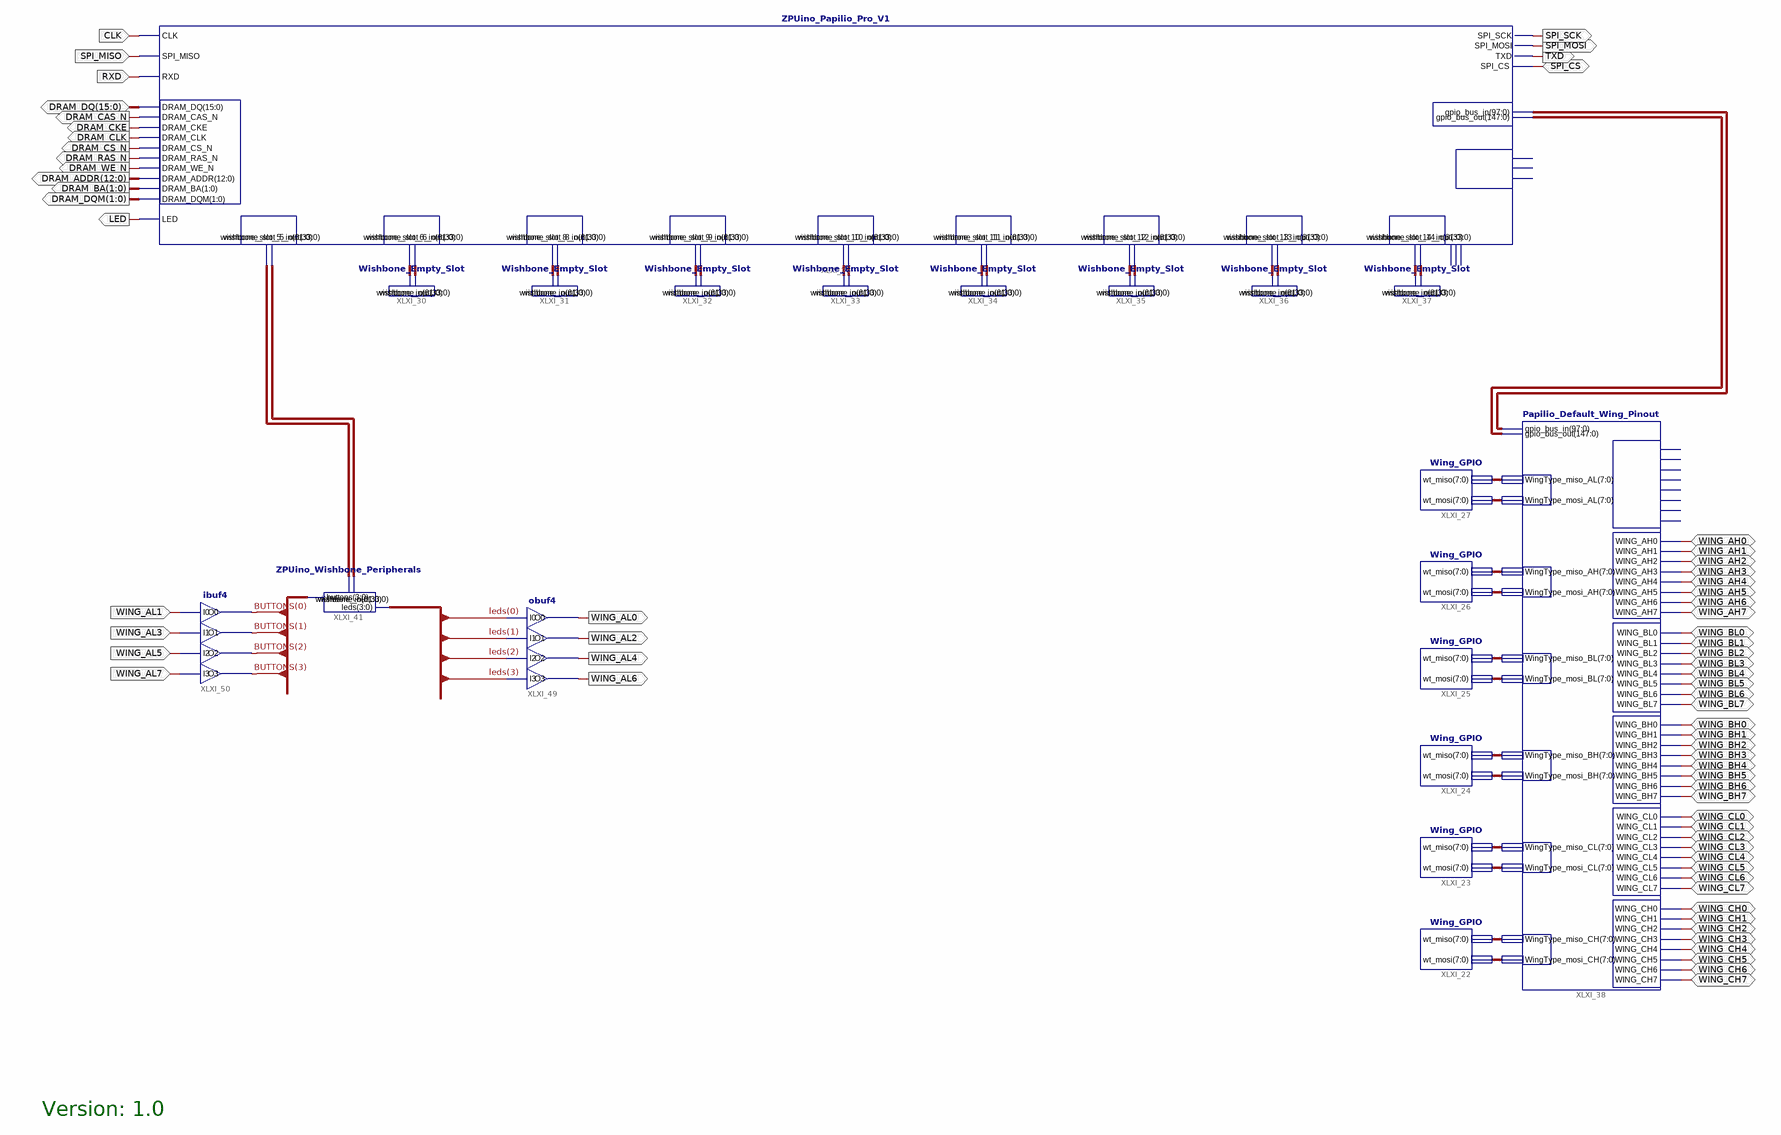
[diagram p0: schematic sheet 1]
// Xilinx ISE schematic Papilio_Pro.sch (spartan6) as structural Verilog: 19 symbols, 66 ports
module Papilio_Pro (
  input  RXD,
  input  SPI_MISO,
  input  CLK,
  input  WING_AL1,
  input  WING_AL3,
  input  WING_AL5,
  input  WING_AL7,
  inout  WING_AH0,
  inout  WING_AH1,
  inout  WING_AH2,
  inout  WING_AH3,
  inout  WING_AH4,
  inout  WING_AH5,
  inout  WING_AH6,
  inout  WING_AH7,
  inout  WING_BL0,
  inout  WING_BL1,
  inout  WING_BL2,
  inout  WING_BL3,
  inout  WING_BL4,
  inout  WING_BL5,
  inout  WING_BL6,
  inout  WING_BL7,
  inout  WING_BH0,
  inout  WING_BH1,
  inout  WING_BH2,
  inout  WING_BH3,
  inout  WING_BH4,
  inout  WING_BH5,
  inout  WING_BH6,
  inout  WING_BH7,
  inout  WING_CL0,
  inout  WING_CL1,
  inout  WING_CL2,
  inout  WING_CL3,
  inout  WING_CL4,
  inout  WING_CL5,
  inout  WING_CL6,
  inout  WING_CL7,
  inout  WING_CH0,
  inout  WING_CH1,
  inout  WING_CH2,
  inout  WING_CH3,
  inout  WING_CH4,
  inout  WING_CH5,
  inout  WING_CH6,
  inout  WING_CH7,
  inout  [15:0] DRAM_DQ,
  inout  SPI_CS,
  output DRAM_CAS_N,
  output DRAM_CKE,
  output DRAM_CLK,
  output DRAM_CS_N,
  output DRAM_RAS_N,
  output DRAM_WE_N,
  output [12:0] DRAM_ADDR,
  output [1:0] DRAM_BA,
  output [1:0] DRAM_DQM,
  output LED,
  output TXD,
  output SPI_MOSI,
  output SPI_SCK,
  output WING_AL0,
  output WING_AL2,
  output WING_AL4,
  output WING_AL6
);

  wire [3:0] BUTTONS, leds;
  wire [7:0] XLXN_325, XLXN_326, XLXN_327, XLXN_328, XLXN_329, XLXN_330, XLXN_331, XLXN_332, XLXN_333,
       XLXN_334, XLXN_335, XLXN_336;
  wire [33:0] XLXN_431, XLXN_433, XLXN_435, XLXN_437, XLXN_439, XLXN_441, XLXN_443, XLXN_445, XLXN_451;
  wire [61:0] XLXN_430, XLXN_432, XLXN_434, XLXN_436, XLXN_438, XLXN_440, XLXN_442, XLXN_444, XLXN_450;
  wire [97:0] XLXN_409;
  wire [147:0] XLXN_408;

  ZPUino_Papilio_Pro_V1 XLXI_28 (
    .gpio_bus_out(XLXN_408), .gpio_bus_in(XLXN_409), .SPI_CS(SPI_CS), .TXD(TXD), .SPI_MOSI(SPI_MOSI),
    .SPI_SCK(SPI_SCK), .DRAM_DQ(DRAM_DQ), .LED(LED), .DRAM_CAS_N(DRAM_CAS_N), .DRAM_CKE(DRAM_CKE),
    .DRAM_CLK(DRAM_CLK), .DRAM_CS_N(DRAM_CS_N), .DRAM_RAS_N(DRAM_RAS_N), .DRAM_WE_N(DRAM_WE_N),
    .DRAM_ADDR(DRAM_ADDR), .DRAM_BA(DRAM_BA), .DRAM_DQM(DRAM_DQM), .CLK(CLK), .SPI_MISO(SPI_MISO), .RXD(RXD),
    .wishbone_slot_5_out(XLXN_451), .wishbone_slot_5_in(XLXN_450), .wishbone_slot_6_in(XLXN_444),
    .wishbone_slot_6_out(XLXN_445), .wishbone_slot_8_in(XLXN_442), .wishbone_slot_8_out(XLXN_443),
    .wishbone_slot_9_in(XLXN_440), .wishbone_slot_9_out(XLXN_441), .wishbone_slot_10_in(XLXN_438),
    .wishbone_slot_10_out(XLXN_439), .wishbone_slot_11_in(XLXN_436), .wishbone_slot_11_out(XLXN_437),
    .wishbone_slot_12_in(XLXN_434), .wishbone_slot_12_out(XLXN_435), .wishbone_slot_13_in(XLXN_432),
    .wishbone_slot_13_out(XLXN_433), .wishbone_slot_14_in(XLXN_430), .wishbone_slot_14_out(XLXN_431));  // open: clk_96Mhz, clk_1Mhz, clk_osc_32Mhz, wishbone_slot_video_in, wishbone_slot_video_out, vgaclkout
  Wishbone_Empty_Slot XLXI_37 (.wishbone_in(XLXN_430), .wishbone_out(XLXN_431));
  Wishbone_Empty_Slot XLXI_36 (.wishbone_in(XLXN_432), .wishbone_out(XLXN_433));
  Wishbone_Empty_Slot XLXI_35 (.wishbone_in(XLXN_434), .wishbone_out(XLXN_435));
  Wishbone_Empty_Slot XLXI_34 (.wishbone_in(XLXN_436), .wishbone_out(XLXN_437));
  Wishbone_Empty_Slot XLXI_33 (.wishbone_in(XLXN_438), .wishbone_out(XLXN_439));
  Wishbone_Empty_Slot XLXI_32 (.wishbone_in(XLXN_440), .wishbone_out(XLXN_441));
  Wishbone_Empty_Slot XLXI_31 (.wishbone_in(XLXN_442), .wishbone_out(XLXN_443));
  Wishbone_Empty_Slot XLXI_30 (.wishbone_in(XLXN_444), .wishbone_out(XLXN_445));
  Wing_GPIO XLXI_27 (.wt_miso(XLXN_335), .wt_mosi(XLXN_336));
  Wing_GPIO XLXI_26 (.wt_miso(XLXN_333), .wt_mosi(XLXN_334));
  Wing_GPIO XLXI_25 (.wt_miso(XLXN_331), .wt_mosi(XLXN_332));
  Wing_GPIO XLXI_24 (.wt_miso(XLXN_329), .wt_mosi(XLXN_330));
  Wing_GPIO XLXI_23 (.wt_miso(XLXN_327), .wt_mosi(XLXN_328));
  Wing_GPIO XLXI_22 (.wt_miso(XLXN_325), .wt_mosi(XLXN_326));
  Papilio_Default_Wing_Pinout XLXI_38 (
    .WING_AH0(WING_AH0), .WING_AH1(WING_AH1), .WING_AH2(WING_AH2), .WING_AH3(WING_AH3), .WING_AH4(WING_AH4),
    .WING_AH5(WING_AH5), .WING_AH6(WING_AH6), .WING_AH7(WING_AH7), .WING_BH0(WING_BH0), .WING_BH1(WING_BH1),
    .WING_BH2(WING_BH2), .WING_BH3(WING_BH3), .WING_BH4(WING_BH4), .WING_BH5(WING_BH5), .WING_BH6(WING_BH6),
    .WING_BH7(WING_BH7), .WING_BL0(WING_BL0), .WING_BL1(WING_BL1), .WING_BL2(WING_BL2), .WING_BL3(WING_BL3),
    .WING_BL4(WING_BL4), .WING_BL5(WING_BL5), .WING_BL6(WING_BL6), .WING_BL7(WING_BL7), .WING_CL0(WING_CL0),
    .WING_CL1(WING_CL1), .WING_CL2(WING_CL2), .WING_CL3(WING_CL3), .WING_CL4(WING_CL4), .WING_CL5(WING_CL5),
    .WING_CL6(WING_CL6), .WING_CL7(WING_CL7), .WING_CH0(WING_CH0), .WING_CH1(WING_CH1), .WING_CH2(WING_CH2),
    .WING_CH3(WING_CH3), .WING_CH4(WING_CH4), .WING_CH5(WING_CH5), .WING_CH6(WING_CH6), .WING_CH7(WING_CH7),
    .gpio_bus_out(XLXN_408), .gpio_bus_in(XLXN_409), .WingType_miso_BH(XLXN_329),
    .WingType_miso_BL(XLXN_331), .WingType_miso_AH(XLXN_333), .WingType_mosi_BL(XLXN_332),
    .WingType_mosi_BH(XLXN_330), .WingType_mosi_CL(XLXN_328), .WingType_mosi_AH(XLXN_334),
    .WingType_miso_CL(XLXN_327), .WingType_miso_CH(XLXN_325), .WingType_mosi_CH(XLXN_326),
    .WingType_mosi_AL(XLXN_336), .WingType_miso_AL(XLXN_335));  // open: WING_AL0, WING_AL1, WING_AL2, WING_AL3, WING_AL4, WING_AL5, WING_AL6, WING_AL7
  ZPUino_Wishbone_Peripherals XLXI_41 (.buttons(BUTTONS), .leds(leds), .wishbone_in(XLXN_450), .wishbone_out(XLXN_451));
  obuf4 XLXI_49 (
    .I0(leds[0]), .I1(leds[1]), .I2(leds[2]), .I3(leds[3]), .O0(WING_AL0), .O1(WING_AL2), .O2(WING_AL4),
    .O3(WING_AL6));
  ibuf4 XLXI_50 (
    .I0(WING_AL1), .I1(WING_AL3), .I2(WING_AL5), .I3(WING_AL7), .O0(BUTTONS[0]), .O1(BUTTONS[1]),
    .O2(BUTTONS[2]), .O3(BUTTONS[3]));

  // Notes on the sheet:
  //   Version: 1.0
endmodule
